# EAGLE schematic nhb11 (EAGLE 5.08)
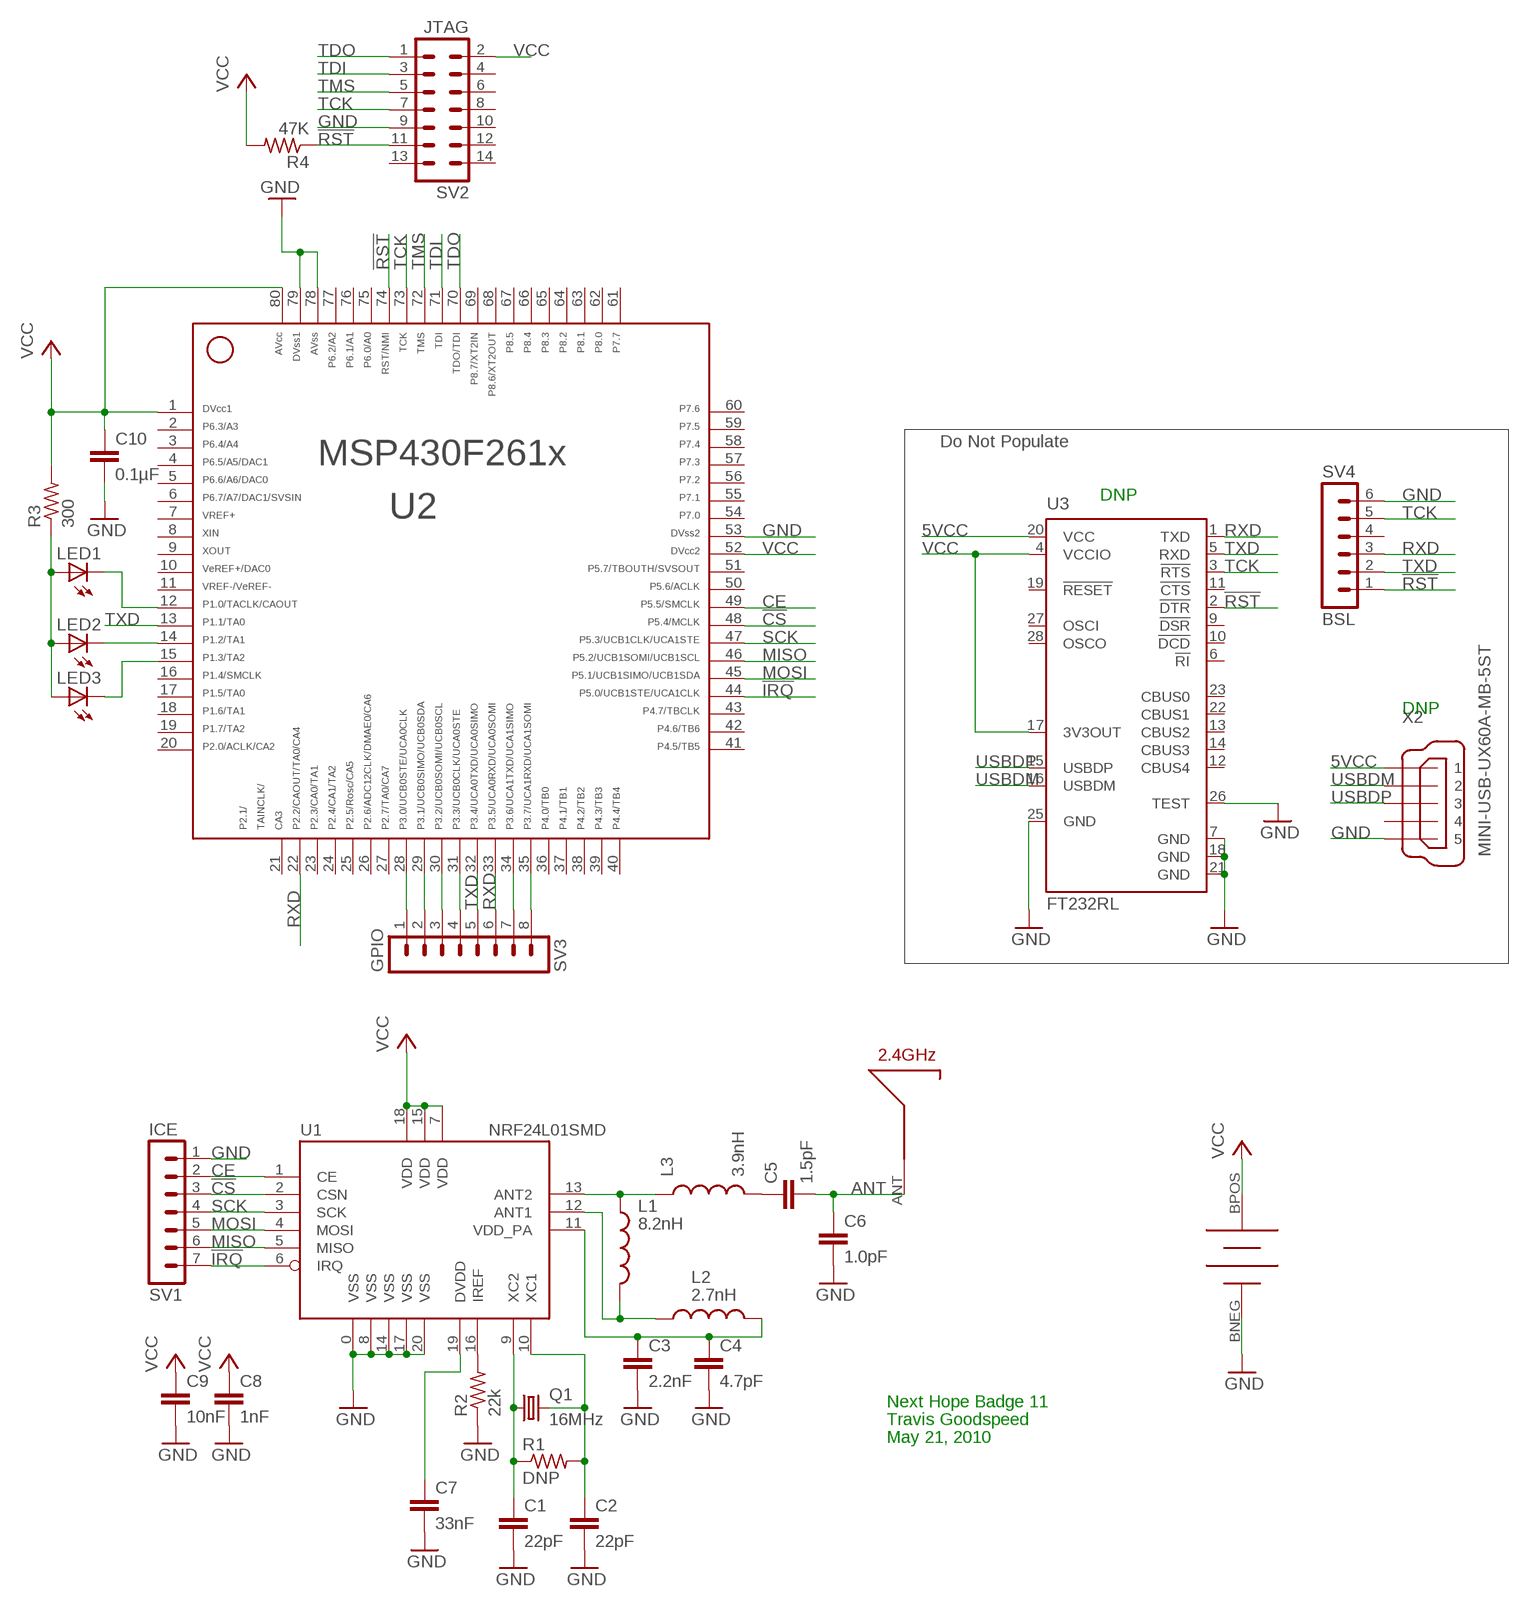
[diagram p0: schematic, sheet 1]

## Parts
C1  22pF  C-EUC0603  [C0603]
C2  22pF  C-EUC0603  [C0603]
C3  2.2nF  C-EUC0603  [C0603]
C4  4.7pF  C-EUC0603  [C0603]
C5  1.5pF  C-EUC0603  [C0603]
C6  1.0pF  C-EUC0603  [C0603]
C7  33nF  C-EUC0603  [C0603]
C8  1nF  C-EUC0603  [C0603]
C9  10nF  C-EUC0603  [C0603]
C10  0.1µF  C-EUC0603  [C0603]
L1  8.2nH  INDUCTOR0603  [0603]
L2  2.7nH  INDUCTOR0603  [0603]
L3  3.9nH  INDUCTOR0603  [0603]
LED1  LEDCHIPLED_0603  [CHIPLED_0603]
LED2  LEDCHIPLED_0603  [CHIPLED_0603]
LED3  LEDCHIPLED_0603  [CHIPLED_0603]
Q1  16MHz  CRYSTALSM49  [SM49]
R1  DNP  R-US_R0603  [R0603]
R2  22k  R-US_R0603  [R0603]
R3  300  R-US_R0603  [R0603]
R4  47K  R-US_R0603  [R0603]
SV1  ICE  MA07-1  [MA07-1]
SV2  JTAG  MA07-2  [MA07-2]
SV3  GPIO  MA08-1  [MA08-1]
SV4  BSL  MA06-1  [MA06-1]
U1  NRF24L01SMD  [QFN20]
U2  F261X---PN80  [PN80]
U3  FT232RL  [SSOP28]
U$1  CR2032  [CR2032]
U$2  ANT24  [ANT24]
X2  MINI-USB-UX60A-MB-5ST  [UX60A-MB-5ST]

## Nets
5VCC: U3.20(VCC) X2.1
!CS: SV1.3 U1.2(CSN) U2.48
!IRQ: SV1.7 U1.6(IRQ) U2.44
!RST: R4.1 SV2.11 SV4.1 U2.74 U3.2(!DTR)
ANT: C5.2 C6.1 U$2.ANT
CE: SV1.2 U1.1(CE) U2.49
GND: C1.2 C2.2 C3.2 C4.2 C6.2 C7.2 C8.2 C9.2 C10.2 R2.1 SV1.1 SV2.9 SV4.6 U1.0(VSS) U1.8(VSS) U1.14(VSS) U1.17(VSS) U1.20(VSS) U2.53 U2.78 U2.79 U3.7(GND) U3.18(GND) U3.21(GND) U3.25(GND) U3.26(TEST) U$1.BNEG(BATGND) X2.5
MISO: SV1.6 U1.5(MISO) U2.46
MOSI: SV1.5 U1.4(MOSI) U2.45
N$1: C1.1 Q1.1 R1.1 U1.9(XC2)
N$2: C2.1 Q1.2 R1.2 U1.10(XC1)
N$3: R2.2 U1.16(IREF)
N$4: C7.1 U1.19(DVDD)
N$5: C3.1 C4.1 L2.2 U1.11(VDD_PA)
N$6: C5.1 L3.2
N$7: L1.2 L2.1 U1.12(ANT1)
N$8: SV3.1 U2.28
N$9: L1.1 L3.1 U1.13(ANT2)
N$10: LED1.A LED2.A LED3.A R3.1
N$11: SV3.2 U2.29
N$12: LED1.C U2.12
N$13: LED3.C U2.15
N$14: LED2.C U2.14
N$15: SV3.3 U2.30
N$16: SV3.4 U2.31
N$19: SV3.7 U2.34
N$23: SV3.8 U2.35
RXD: SV3.6 SV4.3 U2.22 U2.33 U3.1(TXD)
SCK: SV1.4 U1.3(SCK) U2.47
TCK: SV2.7 SV4.5 U2.73 U3.3(!RTS)
TDI: SV2.3 U2.71
TDO: SV2.1 U2.70
TMS: SV2.5 U2.72
TXD: SV3.5 SV4.2 U2.13 U2.32 U3.5(RXD)
USBDM: U3.16(USBDM) X2.2
USBDP: U3.15(USBDP) X2.3
VCC: C8.1 C9.1 C10.1 R3.2 R4.2 SV2.2 U1.7(VDD) U1.15(VDD) U1.18(VDD) U2.1 U2.52 U2.80 U3.4(VCCIO) U3.17(3V3OUT) U$1.BPOS(BATVCC)
Unconnected: SV2.4 SV2.6 SV2.8 SV2.10 SV2.12 SV2.13 SV2.14 SV4.4 U2.2 U2.3 U2.4 U2.5 U2.6 U2.7 U2.8 U2.9 U2.10 U2.11 U2.16 U2.17 U2.18 U2.19 U2.20 U2.21 U2.23 U2.24 U2.25 U2.26 U2.27 U2.36 U2.37 U2.38 U2.39 U2.40 U2.41 U2.42 U2.43 U2.50 U2.51 U2.54 U2.55 U2.56 U2.57 U2.58 U2.59 U2.60 U2.61 U2.62 U2.63 U2.64 U2.65 U2.66 U2.67 U2.68 U2.69 U2.75 U2.76 U2.77 U3.6(!RI) U3.9(!DSR) U3.10(!DCD) U3.11(!CTS) U3.12(CBUS4) U3.13(CBUS2) U3.14(CBUS3) U3.19(!RESET) U3.22(CBUS1) U3.23(CBUS0) U3.27(OSCI) U3.28(OSCO) X2.4

## Notes on the sheet
- Do Not Populate
- DNP
- DNP
- Next Hope Badge 11
- Travis Goodspeed
- May 21, 2010

## Library data of the parts
C1-C10 = rcl:C-EU: CAPACITOR, European symbol
L1-L3 = SparkFun:INDUCTOR: Inductors Basic Inductor/Choke - 0603 and 1206. Footprints are not proven and vary greatly between part numbers.
LED1-LED3 = led:LED: LED OSRAM: - CHIPLED LG R971, LG N971, LY N971, LG Q971, LY Q971, LO R971, LY R971 LH N974, LH R974 LS Q976, LO Q976, LY Q976 LO Q996 - Hyper CHIPLED LW Q18S LB Q993, LB Q99A, LB R99A - SideLED LS A670, LO A670, LY A670, LG A670, LP A670 LB A673, LV A673, LT A673, LW A673 LH A674 LY A675 LS A676, LA A676, LO A676, LY A676, LW A676 LS A679, LY A679, LG A679 - Hyper Micro SIDELED® LS Y876, LA Y876, LO Y876, LY Y876 LT Y87S - SmartLED LW L88C, LW L88S LB L89C, LB L89S, LG L890 LS L89K, LO L89K, LY L89K LS L896, LA L896, LO L896, LY L896 - TOPLED LS T670, LO T670, LY T670, LG T670, LP T670 LSG T670, LSP T670, LSY T670, LOP T670, LYG T670 LG T671, LOG T671, LSG T671 LB T673, LV T673, LT T673, LW T673 LH T674 LS T676, LA T676, LO T676, LY T676, LB T676, LH T676, LSB T676, LW T676 LB T67C, LV T67C, LT T67C, LS T67K, LO T67K, LY T67K, LW E67C LS E67B, LA E67B, LO E67B, LY E67B, LB E67C, LV E67C, LT E67C LW T67C LS T679, LY T679, LG T679 LS T770, LO T770, LY T770, LG T770, LP T770 LB T773, LV T773, LT T773, LW T773 LH T774 LS E675, LA E675, LY E675, LS T675 LS T776, LA T776, LO T776, LY T776, LB T776 LHGB T686 LT T68C, LB T68C - Hyper Mini TOPLED® LB M676 - Mini TOPLED Santana® LG M470 LS M47K, LO M47K, LY M47K Source: http://www.osram.convergy.de LUXEON: - LUMILED® LXK2-PW12-R00, LXK2-PW12-S00, LXK2-PW14-U00, LXK2-PW14-V00 LXK2-PM12-R00, LXK2-PM12-S00, LXK2-PM14-U00 LXK2-PE12-Q00, LXK2-PE12-R00, LXK2-PE12-S00, LXK2-PE14-T00, LXK2-PE14-U00 LXK2-PB12-K00, LXK2-PB12-L00, LXK2-PB12-M00, LXK2-PB14-N00, LXK2-PB14-P00, LXK2-PB14-Q00 LXK2-PR12-L00, LXK2-PR12-M00, LXK2-PR14-Q00, LXK2-PR14-R00 LXK2-PD12-Q00, LXK2-PD12-R00, LXK2-PD12-S00 LXK2-PH12-R00, LXK2-PH12-S00 LXK2-PL12-P00, LXK2-PL12-Q00, LXK2-PL12-R00 Source: www.luxeon.com KINGBRIGHT: KA-3528ASYC Source: www.kingbright.com
Q1 = crystal:CRYSTAL: CRYSTAL
R1-R4 = rcl:R-US_: RESISTOR, American symbol
SV1 = con-lstb:MA07-1: PIN HEADER
SV2 = con-lstb:MA07-2: PIN HEADER
SV3 = con-lstb:MA08-1: PIN HEADER
SV4 = con-lstb:MA06-1: PIN HEADER
U1 = SparkFun:NRF24L01: 2.4GHz Low Power Transceiver This is the very popular, low cost, very low power RF transceiver from Nordic Semiconductor. Simple SPI interface. SKU: COM-00690
U2 = TI_MSP430_v13:F261X---PN80: ***MSP430F261x***PN80
U3 = ftdichip:FT232R: Source: http://www.ftdichip.com/Documents/DataSheets/DS_FT232R_v104.pdf
U$1 = nhb:CR2032
U$2 = nhb:ANT24: 2.45GHz trace antenna. L=23mm=Lambda_g/4 Lambda_0=122mm Lambda_g=0.75*Lambda_0
X2 = con-hirose:MINI-USB-: MINI USB Connector Source: http://www.hirose.co.jp/cataloge_hp/e24000019.pdf